# Altium schematic sheet MPU9250.SchDoc
size A4
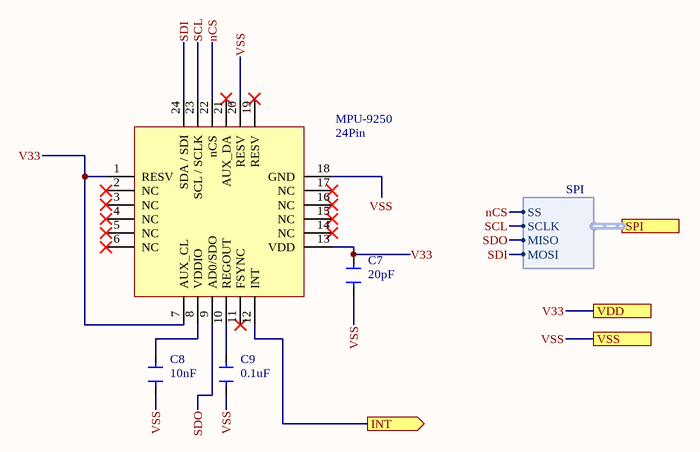
[diagram p0: MPU9250.SchDoc]

## Parts
C7  value 20pF  [CAP_0402]  (hidden comment: Cap)
C8  value 10nF  [CAP_0402]  (hidden comment: Cap)
C9  value 0.1uF  [CAP_0402]  (hidden comment: Cap)
MPU-9250  24Pin  [QFN_24PIN]

## Ports
INT (out), SPI (harness SPI), VDD, VSS

## Harnesses
SPI: SS, SCLK, MISO, MOSI

## Nets
INT: MPU-9250.12(INT) ; port INT
nCS: MPU-9250.22(nCS) ; port SPI.SS
SCL: MPU-9250.23(SCL_/_SCLK) ; port SPI.SCLK
SDI: MPU-9250.24(SDA_/_SDI) ; port SPI.MOSI
SDO: MPU-9250.9(AD0/SDO) ; port SPI.MISO
V33: C7.1 MPU-9250.1(RESV) MPU-9250.7(AUX_CL) MPU-9250.13(VDD) ; port VDD
VSS: C7.2 C8.2 C9.2 MPU-9250.18(GND) MPU-9250.20(RESV) ; port VSS
NetC8_1: C8.1 MPU-9250.8(VDDIO)
NetC9_1: C9.1 MPU-9250.10(REGOUT)

Not connected (* = marked no-connect by the designer): MPU-9250 2(NC)* 3(NC)* 4(NC)* 5(NC)* 6(NC)* 11(FSYNC)* 14(NC)* 15(NC)* 16(NC)* 17(NC)* 19(RESV)* 21(AUX_DA)*

## Library data of the parts
MPU-9250 = MPU-9250_2